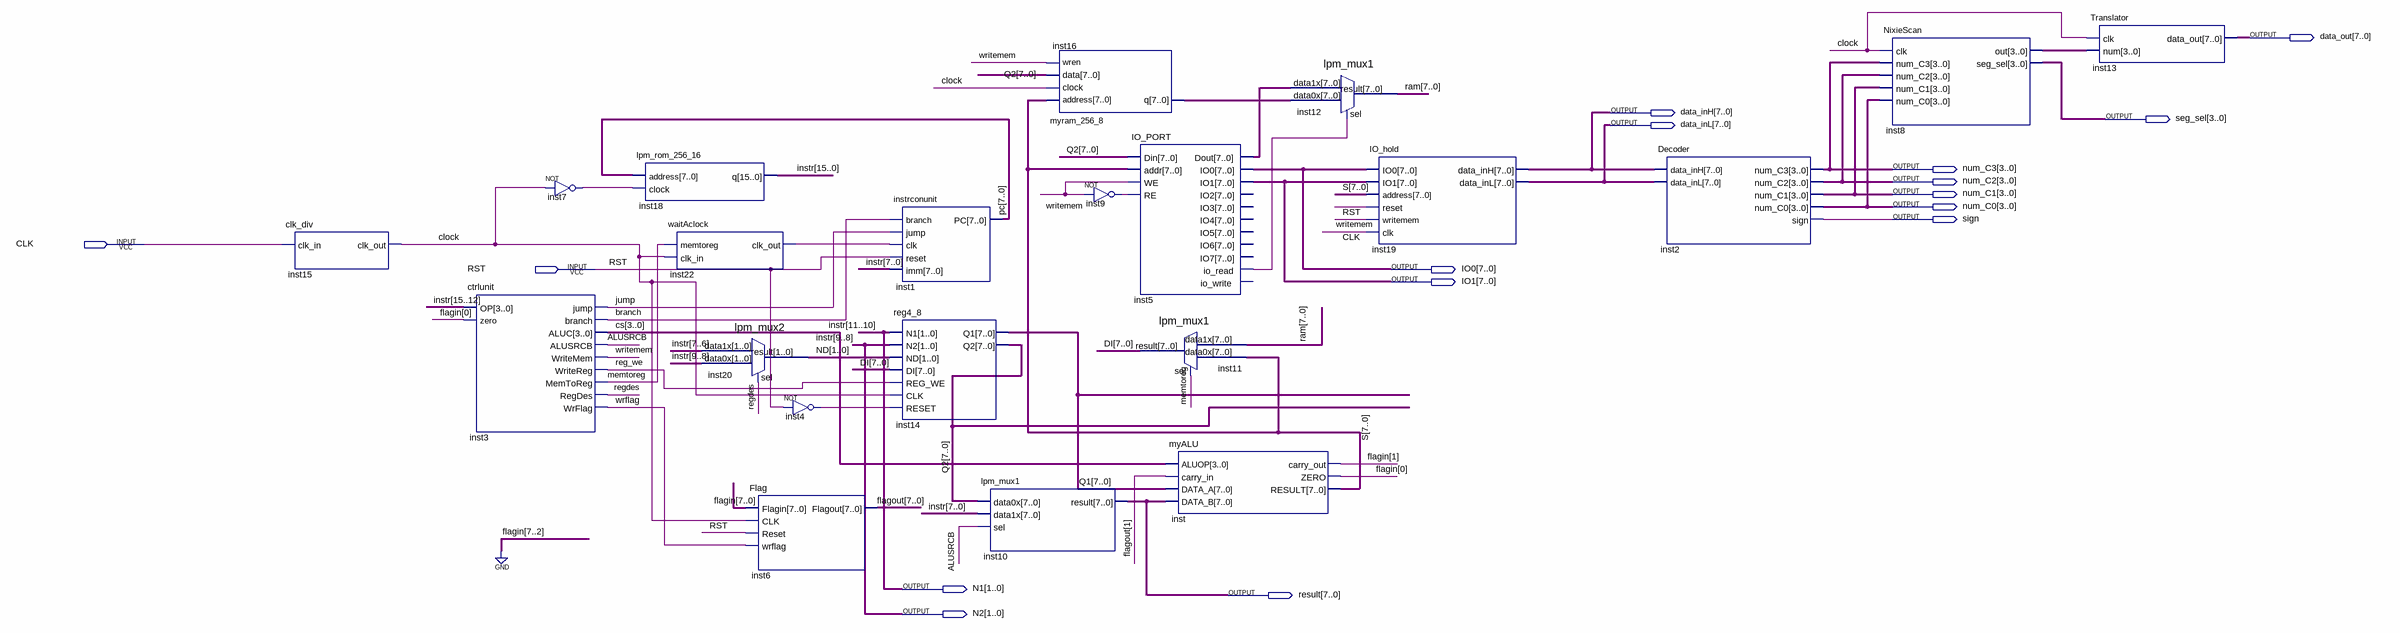
[diagram p0: schematic sheet]
// Quartus schematic systemB.bdf as structural Verilog: 21 symbols, 16 pins
module systemB (
  input  CLK,
  input  RST,
  output [7:0] data_out,
  output [7:0] data_inH,
  output [3:0] seg_sel,
  output [7:0] data_inL,
  output [3:0] num_C3,
  output [3:0] num_C2,
  output [3:0] num_C1,
  output [3:0] num_C0,
  output sign,
  output [7:0] IO0,
  output [7:0] IO1,
  output [1:0] N1,
  output [7:0] result,
  output [1:0] N2
);

  wire ALUSRCB, branch, clock, inst4_out, inst5_io_read, inst7_out, inst9_out, inst22_clk_out, jump,
       memtoreg, reg_we, regdes, wrflag, writemem;
  wire [1:0] flagin, ND;
  wire [3:0] cs, inst8_out;
  wire [7:0] DI, flagout, inst5_dout, inst16_q, pc, Q1, Q2, ram, S;
  wire [15:0] instr;

  clk_div inst15 (.clk_in(CLK), .clk_out(clock));
  ctrlunit inst3 (
    .OP(instr[15:12]), .zero(flagin[0]), .jump(jump), .branch(branch), .ALUC(cs), .ALUSRCB(ALUSRCB),
    .WriteMem(writemem), .WriteReg(reg_we), .MemToReg(memtoreg), .RegDes(regdes), .WrFlag(wrflag));
  not inst7 (inst7_out, clock);
  lpm_rom_256_16 inst18 (.address(pc), .clock(inst7_out), .q({instr[15:12], N1, N2, instr[7:0]}));
  waitAclock inst22 (.memtoreg(memtoreg), .clk_in(clock), .clk_out(inst22_clk_out));
  lpm_mux2 inst20 (.data1x(instr[7:6]), .data0x(N2), .sel(regdes), .result(ND));
  not inst4 (inst4_out, RST);
  Flag inst6 (.Flagin({{6{1'b0}}, flagin}), .CLK(clock), .Reset(RST), .wrflag(wrflag), .Flagout(flagout));
  instrconunit inst1 (.branch(branch), .jump(jump), .clk(inst22_clk_out), .reset(RST), .imm(instr[7:0]), .PC(pc));
  reg4_8 inst14 (.N2(N2), .ND(ND), .REG_WE(reg_we), .DI(DI), .CLK(clock), .RESET(inst4_out), .N1(N1), .Q2(Q2), .Q1(Q1));
  lpm_mux1 inst10 (.data0x(Q2), .data1x(instr[7:0]), .sel(ALUSRCB), .result(result));
  myram_256_8 inst16 (.address(S), .clock(clock), .data(Q2), .wren(writemem), .q(inst16_q));
  not inst9 (inst9_out, writemem);
  IO_PORT inst5 (
    .Din(Q2), .addr(S), .WE(writemem), .RE(inst9_out), .Dout(inst5_dout), .io_read(inst5_io_read), .IO0(IO0),
    .IO1(IO1));  // open: io_write, IO2, IO3, IO4, IO5, IO6, IO7
  lpm_mux1 inst11 (.data1x(ram), .data0x(S), .sel(memtoreg), .result(DI));
  myALU inst (
    .ALUOP(cs), .carry_in(flagout[1]), .DATA_A(Q1), .DATA_B(result), .carry_out(flagin[1]), .ZERO(flagin[0]),
    .RESULT(S));
  lpm_mux1 inst12 (.data1x(inst5_dout), .data0x(inst16_q), .sel(inst5_io_read), .result(ram));
  IO_hold inst19 (
    .IO0(IO0), .IO1(IO1), .address(S), .reset(RST), .writemem(writemem), .clk(CLK), .data_inH(data_inH),
    .data_inL(data_inL));
  Decoder inst2 (
    .data_inH(data_inH), .data_inL(data_inL), .num_C3(num_C3), .num_C2(num_C2), .num_C1(num_C1),
    .num_C0(num_C0), .sign(sign));
  NixieScan inst8 (
    .clk(clock), .num_C3(num_C3), .num_C2(num_C2), .num_C1(num_C1), .num_C0(num_C0), .out(inst8_out),
    .seg_sel(seg_sel));
  Translator inst13 (.clk(clock), .num(inst8_out), .data_out(data_out));

  // Other names for the same wires on the sheet: instr[11:8] = {N1, N2}
endmodule
